# Altium schematic sheet LED0805-8_Sch.SchDoc: LED0805-8
size 127 x 101 mm; Author: Hom; CompanyName: KitSprout; DrawnBy: Hom; Engineer: Hom; Organization: KitSprout; Revision: A; SheetNumber: 1; SheetTotal: 1; License: CC BY-SA 4.0; Version: 1.0; LibVersion: 1.0; PageSetup: Record=PageOptions|CenterHorizontal=True|CenterVertical=True|PrintScale=1.00|XCorrection=1.00|YCorrection=1.00|PrintKind=0|BorderSize=5000000|LeftOffset=0|BottomOffset=0|Orientation=2|PaperLength=1000|PaperWidth=1000|Scale=100|PaperSource=7|PrintQuality=-4|MediaType=1|DitherType=10|PaperKind=A4|PrintScaleMode=0
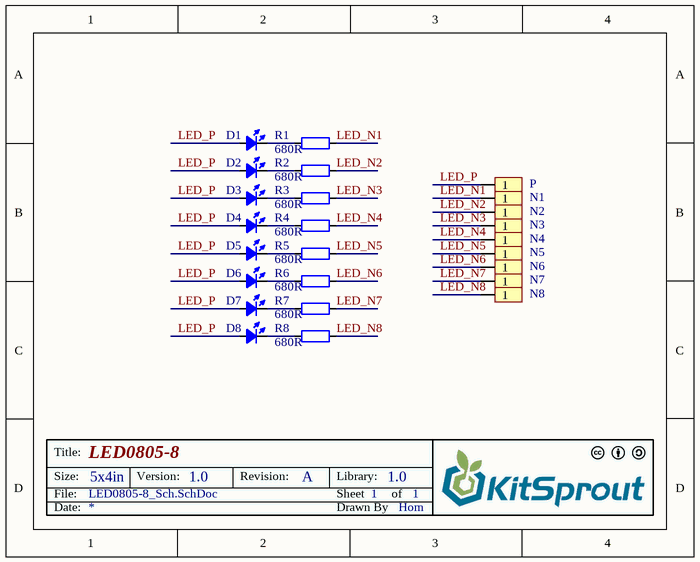
[diagram p0: LED0805-8_Sch.SchDoc]

## Parts
D1  LED_0805  [LED_0805_BLUE]  (value not drawn)
D2  LED_0805  [LED_0805_BLUE]  (value not drawn)
D3  LED_0805  [LED_0805_BLUE]  (value not drawn)
D4  LED_0805  [LED_0805_BLUE]  (value not drawn)
D5  LED_0805  [LED_0805_BLUE]  (value not drawn)
D6  LED_0805  [LED_0805_BLUE]  (value not drawn)
D7  LED_0805  [LED_0805_BLUE]  (value not drawn)
D8  LED_0805  [LED_0805_BLUE]  (value not drawn)
N1  HDR-PAD_2.54  [HDR-PAD_2.54]  (value not drawn)
N2  HDR-PAD_2.54  [HDR-PAD_2.54]  (value not drawn)
N3  HDR-PAD_2.54  [HDR-PAD_2.54]  (value not drawn)
N4  HDR-PAD_2.54  [HDR-PAD_2.54]  (value not drawn)
N5  HDR-PAD_2.54  [HDR-PAD_2.54]  (value not drawn)
N6  HDR-PAD_2.54  [HDR-PAD_2.54]  (value not drawn)
N7  HDR-PAD_2.54  [HDR-PAD_2.54]  (value not drawn)
N8  HDR-PAD_2.54  [HDR-PAD_2.54]  (value not drawn)
P  HDR-PAD_2.54  [HDR-PAD_2.54]  (value not drawn)
R1  value 680R  [RES_0805]  (hidden comment: Res_0805)
R2  value 680R  [RES_0805]  (hidden comment: Res_0805)
R3  value 680R  [RES_0805]  (hidden comment: Res_0805)
R4  value 680R  [RES_0805]  (hidden comment: Res_0805)
R5  value 680R  [RES_0805]  (hidden comment: Res_0805)
R6  value 680R  [RES_0805]  (hidden comment: Res_0805)
R7  value 680R  [RES_0805]  (hidden comment: Res_0805)
R8  value 680R  [RES_0805]  (hidden comment: Res_0805)

## Nets
LED_N1: N1.1 R1.2
LED_N2: N2.1 R2.2
LED_N3: N3.1 R3.2
LED_N4: N4.1 R4.2
LED_N5: N5.1 R5.2
LED_N6: N6.1 R6.2
LED_N7: N7.1 R7.2
LED_N8: N8.1 R8.2
LED_P: D1.1(A) D2.1(A) D3.1(A) D4.1(A) D5.1(A) D6.1(A) D7.1(A) D8.1(A) P.1
NetD1_2: D1.2(K) R1.1
NetD2_2: D2.2(K) R2.1
NetD3_2: D3.2(K) R3.1
NetD4_2: D4.2(K) R4.1
NetD5_2: D5.2(K) R5.1
NetD6_2: D6.2(K) R6.1
NetD7_2: D7.2(K) R7.1
NetD8_2: D8.2(K) R8.1

## Notes on the sheet
- Title:
- Size:
- Date:
- File:
- 5x4in
- Version:
- Revision:
- Sheet
- Drawn By
- Library:
- of

## Library data of the parts
D1-D8 = LED_0805: LED
N1-N8 P = HDR-PAD_2.54: Header
R1-R8 = Res_0805: Resistor